# EAGLE design rpm-meter (EAGLE 6.5.0)
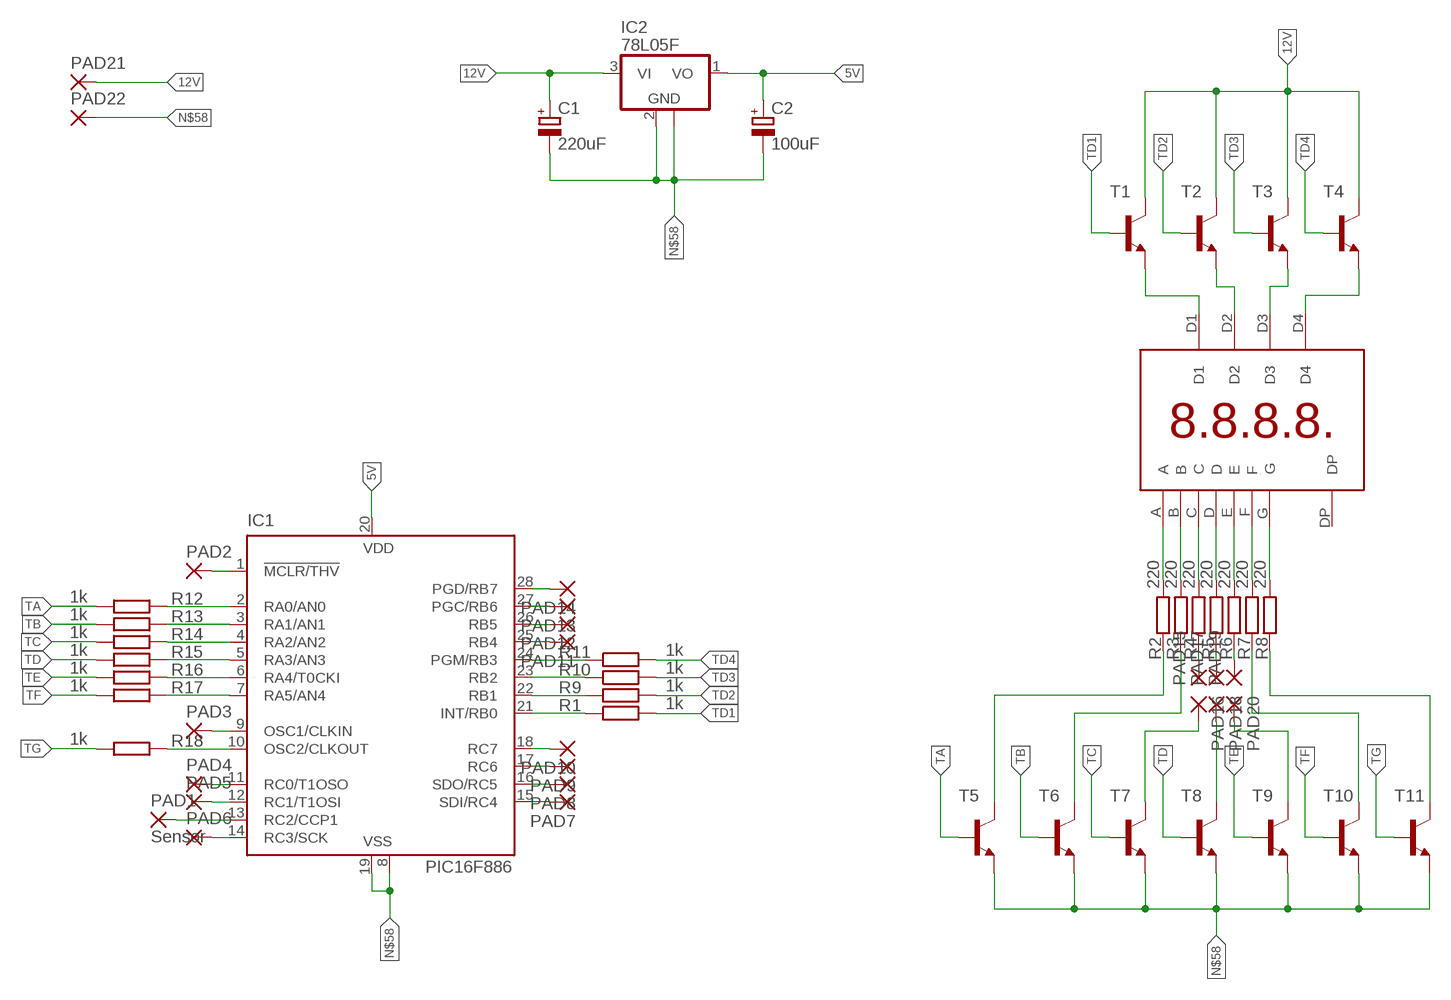
[diagram p0: schematic, sheet 1]

## Parts
C1  220uF  CPOL-EUE5-6  [E5-6]
C2  100uF  CPOL-EUE5-5  [E5-5]
IC1  PIC16F886  PIC16873P  [DIL28-3]
IC2  78L05F  [SOT89]
PAD1  Sensor  SMD5  [SMD2,54-5,08]
PAD2  SMD2  [SMD1,27-2,54]
PAD3  SMD2  [SMD1,27-2,54]
PAD4  SMD2  [SMD1,27-2,54]
PAD5  SMD2  [SMD1,27-2,54]
PAD6  SMD2  [SMD1,27-2,54]
PAD7  SMD2  [SMD1,27-2,54]
PAD8  SMD2  [SMD1,27-2,54]
PAD9  SMD2  [SMD1,27-2,54]
PAD10  SMD2  [SMD1,27-2,54]
PAD11  SMD2  [SMD1,27-2,54]
PAD12  SMD2  [SMD1,27-2,54]
PAD13  SMD2  [SMD1,27-2,54]
PAD14  SMD2  [SMD1,27-2,54]
PAD15  2,54/0,8  [2,54/0,8]
PAD16  2,54/0,8  [2,54/0,8]
PAD17  2,54/0,8  [2,54/0,8]
PAD18  2,54/0,8  [2,54/0,8]
PAD19  2,54/0,8  [2,54/0,8]
PAD20  2,54/0,8  [2,54/0,8]
PAD21  SMD5  [SMD2,54-5,08]
PAD22  SMD5  [SMD2,54-5,08]
R1  1k  R-EU_M0805  [M0805]
R2  220  R-EU_M0805  [M0805]
R3  220  R-EU_M0805  [M0805]
R4  220  R-EU_M0805  [M0805]
R5  220  R-EU_M0805  [M0805]
R6  220  R-EU_M0805  [M0805]
R7  220  R-EU_M0805  [M0805]
R8  220  R-EU_M0805  [M0805]
R9  1k  R-EU_M0805  [M0805]
R10  1k  R-EU_M0805  [M0805]
R11  1k  R-EU_M0805  [M0805]
R12  1k  R-EU_M0805  [M0805]
R13  1k  R-EU_M0805  [M0805]
R14  1k  R-EU_M0805  [M0805]
R15  1k  R-EU_M0805  [M0805]
R16  1k  R-EU_M0805  [M0805]
R17  1k  R-EU_M0805  [M0805]
R18  1k  R-EU_M0805  [M0805]
T1  -NPN-SOT23-EBC  [SOT23-EBC]
T2  -NPN-SOT23-EBC  [SOT23-EBC]
T3  -NPN-SOT23-EBC  [SOT23-EBC]
T4  -NPN-SOT23-EBC  [SOT23-EBC]
T5  -NPN-SOT23-EBC  [SOT23-EBC]
T6  -NPN-SOT23-EBC  [SOT23-EBC]
T7  -NPN-SOT23-EBC  [SOT23-EBC]
T8  -NPN-SOT23-EBC  [SOT23-EBC]
T9  -NPN-SOT23-EBC  [SOT23-EBC]
T10  -NPN-SOT23-EBC  [SOT23-EBC]
T11  -NPN-SOT23-EBC  [SOT23-EBC]
U$1  4X7SEG-CA  [4X7SEG-CA]

## Nets
5V: C2.+ IC1.20(VDD) IC2.1(VO)
12V: C1.+ IC2.3(VI) PAD21.1(P) T1.C T2.C T3.C T4.C
N$2: R2.2 U$1.A
N$3: R3.2 U$1.B
N$4: R4.2 U$1.C
N$5: R5.2 U$1.D
N$6: R6.2 U$1.E
N$7: R7.2 U$1.F
N$8: R8.2 U$1.G
N$9: T2.E U$1.D2
N$10: T3.E U$1.D3
N$11: T1.E U$1.D1
N$12: T4.E U$1.D4
N$13: PAD17.1(P) R5.1
N$14: PAD20.1(P) T9.C
N$15: R7.1 T10.C
N$16: R8.1 T11.C
N$17: PAD16.1(P) T7.C
N$18: R3.1 T6.C
N$19: R2.1 T5.C
N$20: IC1.21(INT/RB0) R1.1
N$21: IC1.22(RB1) R9.1
N$22: IC1.23(RB2) R10.1
N$23: IC1.24(PGM/RB3) R11.1
N$24: IC1.2(RA0/AN0) R12.1
N$25: IC1.3(RA1/AN1) R13.1
N$26: IC1.4(RA2/AN2) R14.1
N$27: IC1.5(RA3/AN3) R15.1
N$28: IC1.6(RA4/T0CKI) R16.1
N$29: IC1.7(RA5/AN4) R17.1
N$30: IC1.10(OSC2/CLKOUT) R18.1
N$31: IC1.13(RC2/CCP1) PAD1.1(P)
N$32: IC1.1(!MCLR/THV) PAD2.1(P)
N$33: IC1.9(OSC1/CLKIN) PAD3.1(P)
N$34: IC1.11(RC0/T1OSO) PAD4.1(P)
N$35: IC1.12(RC1/T1OSI) PAD5.1(P)
N$36: IC1.14(RC3/SCK) PAD6.1(P)
N$37: IC1.15(SDI/RC4) PAD7.1(P)
N$38: IC1.16(SDO/RC5) PAD8.1(P)
N$39: IC1.17(RC6) PAD9.1(P)
N$40: IC1.18(RC7) PAD10.1(P)
N$41: IC1.25(RB4) PAD11.1(P)
N$42: IC1.26(RB5) PAD12.1(P)
N$43: IC1.27(PGC/RB6) PAD13.1(P)
N$44: IC1.28(PGD/RB7) PAD14.1(P)
N$45: PAD15.1(P) R4.1
N$46: PAD19.1(P) R6.1
N$47: PAD18.1(P) T8.C
N$58: C1.- C2.- IC1.8(VSS) IC1.19(VSS) IC2.2(GND) IC2.2@1(GND) PAD22.1(P) T5.E T6.E T7.E T8.E T9.E T10.E T11.E
TA: R12.2 T5.B
TB: R13.2 T6.B
TC: R14.2 T7.B
TD: R15.2 T8.B
TD1: R1.2 T1.B
TD2: R9.2 T2.B
TD3: R10.2 T3.B
TD4: R11.2 T4.B
TE: R16.2 T9.B
TF: R17.2 T10.B
TG: R18.2 T11.B
Unconnected: U$1.DP

## Library data of the parts
C1 C2 = resistor:CPOL-EU: POLARIZED CAPACITOR, European symbol
IC1 = microchip:PIC16*873: MICROCONTROLLER flash type; OC_FARNELL: unknown; OC_NEWARK: unknown
IC2 = linear:78L*: POSITOIV-VOLTAGE REGULATORS Output up to 100 mA Source: http://focus.ti.com/lit/ds/symlink/ua78l05.pdf
PAD1 PAD21 PAD22 = wirepad:SMD5: SMD PAD
PAD2-PAD14 = wirepad:SMD2: SMD PAD
PAD15-PAD20 = wirepad:2,54/0,8: THROUGH-HOLE PAD
R1-R18 = rcl:R-EU_: RESISTOR, European symbol
T1-T11 = transistor:*-NPN-: NPN Transistror BF959 corrected 2008.03.06
U$1 = alijabobija:4X7SEG-CA

## Board
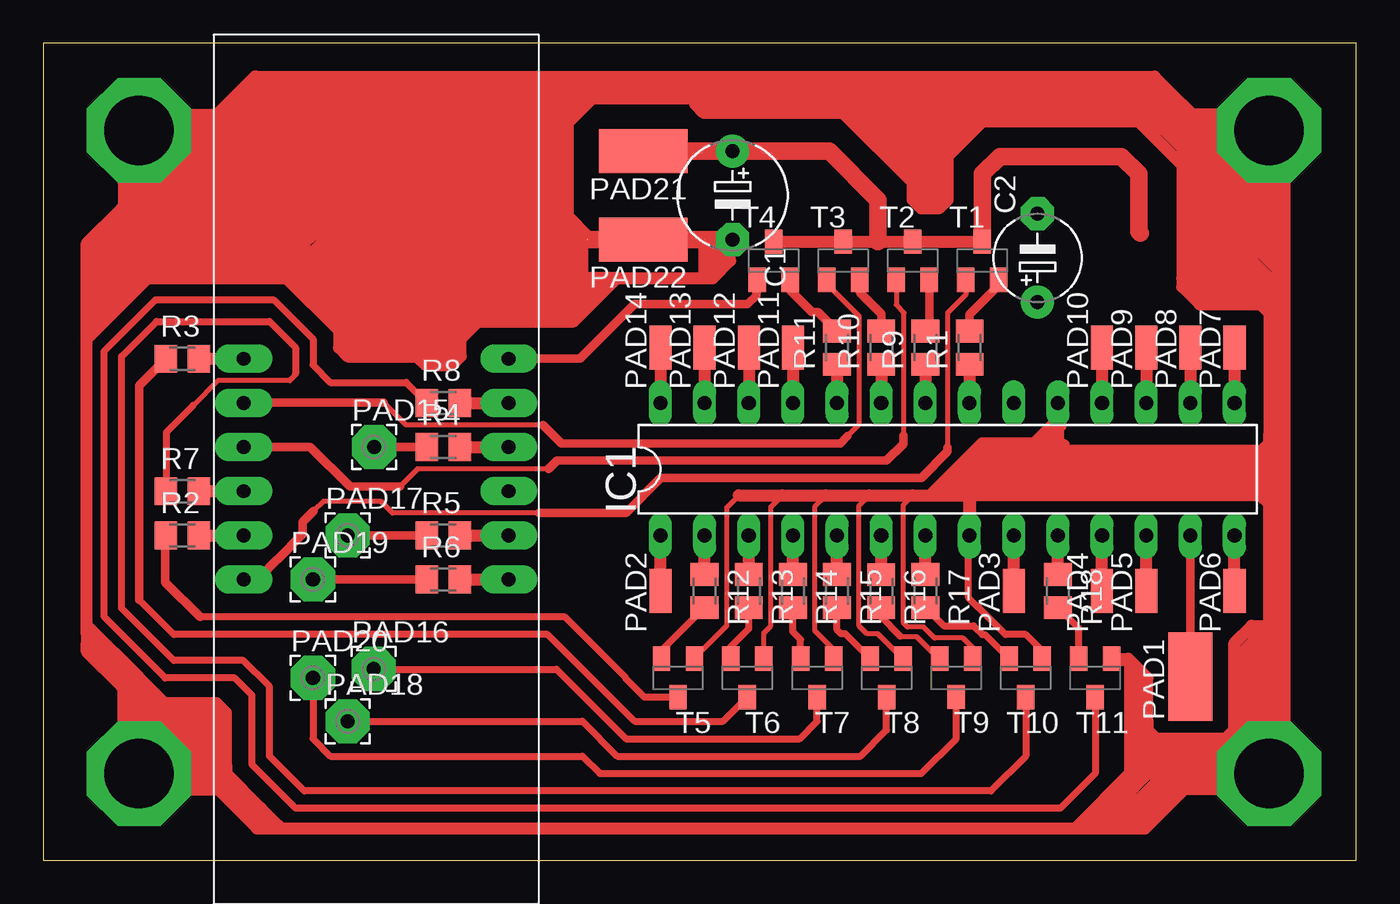
[diagram p1: board, top side]
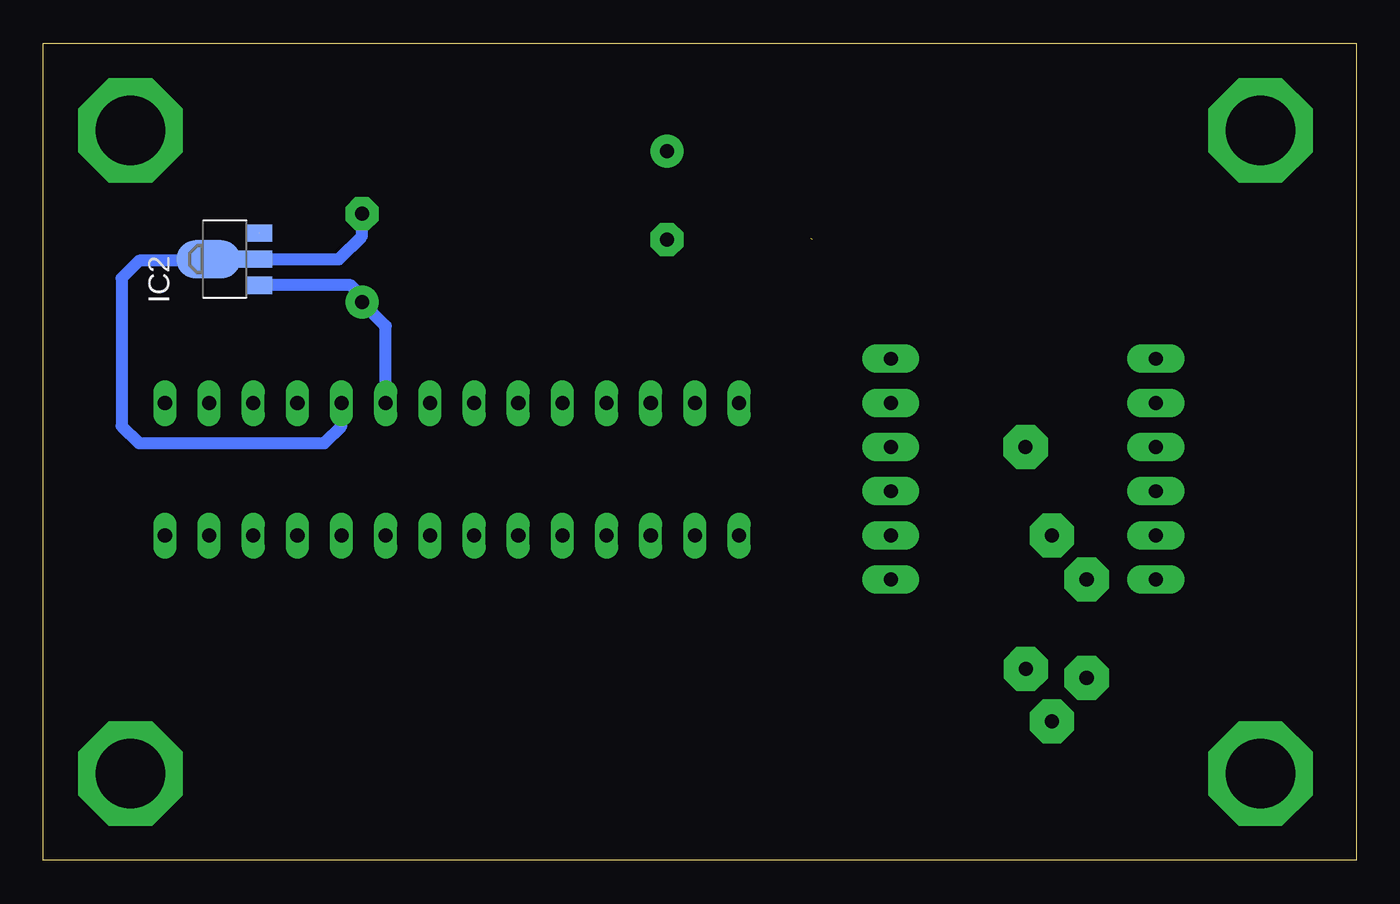
[diagram p2: board, bottom side, seen from below]

Size 75.5 x 47 mm. Coordinates in mm from the lower left corner, seen from the top.
Outline: 0,0 75.5,0 75.5,47 0,47 0,0
Copper layers (1*16): Top 0.035mm / dielectric 1.5mm / Bottom 0.035mm
Design rules "default": minimum track width 10mil, minimum drill 24mil, track to track 8mil, track to pad 8mil, pad to pad 8mil, via to via 8mil, smd to smd 8mil, copper to edge 40mil, drill to drill 8mil, minimum pad ring 10mil, minimum via ring 8mil, stop-mask expansion 4mil, vias tented up to drill 0mil, thermal gap 10mil

### Footprints (pad centres in the part's own frame; a part is rotated, then mirrored left to right if it is on the bottom)
E5-6 = drill 0.813 pad 1.905: + -2.54,0 | drill 0.813 pad 1.905 octagon: - 2.54,0
E5-5 = drill 0.813 pad 1.905: + -2.54,0 | drill 0.813 pad 1.905 octagon: - 2.54,0
DIL28-3 = drill 0.813 long: 1 -16.51,-3.81; 2 -13.97,-3.81; 3 -11.43,-3.81; 4 -8.89,-3.81; 5 -6.35,-3.81; 6 -3.81,-3.81; 7 -1.27,-3.81; 8 1.27,-3.81; 9 3.81,-3.81; 10 6.35,-3.81; 11 8.89,-3.81; 12 11.43,-3.81; 13 13.97,-3.81; 14 16.51,-3.81; 15 16.51,3.81; 16 13.97,3.81; 17 11.43,3.81; 18 8.89,3.81; 19 6.35,3.81; 20 3.81,3.81; 21 1.27,3.81; 22 -1.27,3.81; 23 -3.81,3.81; 24 -6.35,3.81; 25 -8.89,3.81; 26 -11.43,3.81; 27 -13.97,3.81; 28 -16.51,3.81
SOT89 = smd 1 x 1.5: 1 -1.499,-1.981; 3 1.499,-1.981 | smd 1 x 2: 2 0,-1.727 | smd 2.2 x 3.7: 2@1 0,0.94
SMD2,54-5,08 = smd 2.54 x 5.08: 1 0,0
SMD1,27-2,54 = smd 1.27 x 2.54: 1 0,0
2,54/0,8 = drill 0.813 pad 2.54 octagon: 1 0,0
M0805 = smd 1.3 x 1.6: 1 -0.95,0; 2 0.95,0
SOT23-EBC = smd 1 x 1.4: B 0.95,-1.1; C 0,1.1; E -0.95,-1.1
4X7SEG-CA = drill 0.8 pad 1.65 long: A -3.8,7.48; B 6.36,7.48; C 1.28,-7.76; D -3.8,-7.76; D1 -6.34,7.48; D2 1.28,7.48; D3 3.82,7.48; D4 6.36,-7.76; DP -1.26,-7.76; E -6.34,-7.76; F -1.26,7.48; G 3.82,-7.76

### Placement (x,y rotation side)
C1  39.64,38.26 270 top
C2  57.18,34.66 90 top
IC1  52,22.5 0 top
IC2  65.08,34.59 90 bottom
PAD1  65.97,10.58 0 top
PAD2  35.49,15.5 0 top
PAD3  55.81,15.5 0 top
PAD4  60.89,15.5 0 top
PAD5  63.43,15.5 0 top
PAD6  68.51,15.5 0 top
PAD7  68.51,29.5 0 top
PAD8  65.97,29.5 0 top
PAD9  63.43,29.5 0 top
PAD10  60.89,29.5 0 top
PAD11  43.11,29.5 0 top
PAD12  40.57,29.5 0 top
PAD13  38.03,29.5 0 top
PAD14  35.49,29.5 0 top
PAD15  19.01,23.78 0 top
PAD16  19,11.01 0 top
PAD17  17.5,18.7 0 top
PAD18  17.5,8 0 top
PAD19  15.5,16.16 0 top
PAD20  15.5,10.5 0 top
PAD21  34.5,40.8 90 top
PAD22  34.5,35.72 90 top
R1  53.27,29.5 90 top
R2  8,18.7 0 top
R3  8,28.86 0 top
R4  23,23.78 0 top
R5  23,18.7 0 top
R6  23,16.16 0 top
R7  8,21.24 0 top
R8  23,26.32 0 top
R9  50.73,29.5 90 top
R10  48.19,29.5 90 top
R11  45.65,29.5 90 top
R12  38.03,15.5 270 top
R13  40.57,15.5 270 top
R14  43.11,15.5 270 top
R15  45.65,15.5 270 top
R16  48.19,15.49 270 top
R17  50.73,15.5 270 top
R18  58.35,15.5 270 top
T1  54,34.5 0 top
T2  50,34.5 0 top
T3  46,34.5 0 top
T4  42,34.5 0 top
T5  36.5,10.5 180 top
T6  40.49,10.5 180 top
T7  44.5,10.5 180 top
T8  48.5,10.5 180 top
T9  52.5,10.51 180 top
T10  56.5,10.5 180 top
T11  60.5,10.5 180 top
U$1  19,22.5 90 top

### Tracks (layer width: path | path; a pad name or v marks a point on that pad's centre or on a via)
5V
  Bottom 0.7: IC1.20 55.81,30.75 C2.+ 57.18,32.44 57.83,33.09 IC2.1
12V  (1 unrouted)
  Top 0.7: T4.C T3.C 48,35.6 T2.C T1.C
  Top 1: PAD21.1 C1.+ 45.2,40.8 48,38 48,35.6 | T1.C 54,39.5 55,40.5 62,40.5 63,39.5 63,36.19 IC2.3
N$1
  Top 0.7: 11.04,42.27 8.27,42.27 8.09,42.09 8.09,42.44 8.54,42.89 10.52,42.89 10.66,42.75
N$2
  Top 0.7: R2.2 U$1.A
N$3
  Top 0.7: R3.2 U$1.B
N$4
  Top 0.7: R4.2 U$1.C
N$5
  Top 0.7: R5.2 U$1.D
N$6
  Top 0.7: R6.2 U$1.E
N$7
  Top 0.7: R7.2 U$1.F
N$8
  Top 0.7: R8.2 U$1.G
N$9
  Top 0.3: T2.E 49.05,31.95 49.5,31.5 49.47,31.5 49.46,31.51 49.46,24.44 | 29.03,22.49 29.03,22.5 29.05,22.52 21.52,22.52 20.5,21.5
  Top 0.5: 11.55,23.81 U$1.D2 15.35,23.79 17.64,21.5 20.5,21.5 | 49.46,24.44 49.46,23.96 48.5,23 29.53,23 29.05,22.52
N$10
  Top 0.3: T3.E 45.05,33.18 46.91,31.32 46.91,31.31 46.92,31.3 46.92,25.08 46.25,24.41 | 28.72,25.06 28.73,25.05 20.85,25.05 19.57,26.33
  Top 0.5: 11.55,26.29 U$1.D3 19.57,26.33 | 46.25,24.41 45.83,23.99 29.79,23.99 28.73,25.05
N$11
  Top 0.3: T1.E 53.05,32.55 52,31.5 52.02,31.5 52.01,31.49 52.01,23.75 | 28.5,19.98 20.07,19.98 19.41,20.66 16.11,20.66 15.54,20.09
  Top 0.5: 15.54,20.09 14.92,19.47 14.92,18.77 13.46,17.31 13.45,17.31 12.45,16.31 11.67,16.31 U$1.D1 | 52.01,23.75 52.01,23.51 50.5,22 35.5,22 33.5,20 28.52,20 28.5,19.98
N$12
  Top 0.5: U$1.D4 30.86,28.86 34,32 40.5,32 41,32.5 41,33.35 T4.E
N$13
  Top 0.5: R5.1 PAD17.1
N$14
  Top 0.4: PAD20.1 15.5,7 16.5,6 31,6 32,5 50.5,5 52.5,7 T9.C
N$15
  Top 0.3: 14.5,28 14.5,27.94 14.22,27.66 14.22,27.65 14.2,27.63 14.2,27.62 14.18,27.6 10.03,27.6 8.61,26.18
  Top 0.4: 14.5,28 14.5,29.5 13,31 6.5,31 4.5,29 4.5,14.5 7.5,11.5 11.5,11.5 13,10 13,6 15,4 54.5,4 56.5,6 T10.C | 8.61,26.18 8.61,26.17 7.06,24.62 R7.1
N$16
  Top 0.4: R8.1 20.87,27.5 16.5,27.5 15.5,28.5 15.5,30 13.24,32.26 6.45,32.26 3.5,29.31 3.5,14 7,10.5 11,10.5 12,9.5 12,5.5 14.5,3 58.5,3 60.5,5 T11.C
N$17
  Top 0.4: PAD16.1 29.5,11 33.5,7 43.5,7 44.5,8 T7.C
N$18
  Top 0.4: 5.5,15 7.5,13 29,13 34,8 39.09,8 T6.C
  Top 0.5: T6.C 40.49,8.99 | 5.5,15 5.5,27.31 R3.1
N$19
  Top 0.4: T5.C 34.55,9.4 33.5,10.45 33.5,10.5 30,14 9,14
  Top 0.5: R2.1 7,18.65 7,16 9,14 | 36.47,9.37 T5.C
N$20
  Top 0.7: R1.1 IC1.21
N$21
  Top 0.7: R9.1 IC1.22
N$22
  Top 0.7: R10.1 IC1.23
N$23
  Top 0.7: R11.1 IC1.24
N$24
  Top 0.7: R12.1 IC1.2
N$25
  Top 0.7: R13.1 IC1.3
N$26
  Top 0.7: R14.1 IC1.4
N$27
  Top 0.7: R15.1 IC1.5
N$28
  Top 0.7: R16.1 IC1.6
N$29
  Top 0.7: R17.1 IC1.7
N$30
  Top 0.7: R18.1 IC1.10
N$31
  Top 0.5: PAD1.1 IC1.13
N$32
  Top 0.7: PAD2.1 IC1.1
N$33
  Top 0.7: PAD3.1 IC1.9
N$34
  Top 0.7: PAD4.1 IC1.11
N$35
  Top 0.7: PAD5.1 IC1.12
N$36
  Top 0.7: PAD6.1 IC1.14
N$37
  Top 0.7: PAD7.1 IC1.15
N$38
  Top 0.7: PAD8.1 IC1.16
N$39
  Top 0.7: PAD9.1 IC1.17
N$40
  Top 0.7: PAD10.1 IC1.18
N$41
  Top 0.7: PAD11.1 IC1.25
N$42
  Top 0.7: PAD12.1 IC1.26
N$43
  Top 0.7: PAD13.1 IC1.27
N$44
  Top 0.7: PAD14.1 IC1.28
N$45
  Top 0.5: R4.1 PAD15.1
N$46
  Top 0.5: R6.1 PAD19.1
N$47
  Top 0.4: PAD18.1 31,8 33,6 47,6 48.5,7.5 T8.C
N$48
  Top 0.406: 59.5,23 58.85,23 58.85,23.66 58.54,23.66 58.54,23.45
N$51
  Top 0.406: 57.3,23.04 69.95,22.92 | 69.95,22.92 69.95,23.67 | 69.95,23.67 69.95,23.69 58.26,23.74 58.69,24.07 58.81,23.98 57.85,23.33 69.71,23.24 69.73,23.45 59.12,23.55 | 69.58,23.72 69.95,23.67 | 69.95,22.92 69.95,22.47
N$53
  Top 0.7: 70.53,41.99 68.38,41.99 67.48,42.89 65.89,42.89 65.86,42.92
N$54
  Top 0.7: 70.55,4.23 67.64,4.23 67.5,4.09 65.57,4.09 65.44,3.96
N$55
  Top 0.7: 70.98,4.72 66.52,4.72 66.39,4.59
N$56
  Top 0.7: 5.89,5.44 9.46,5.44 9.64,5.62
N$57
  Top 0.7: 63.34,2.48 65.75,4.89
N$58  (via drill 4 pad 6)  (1 unrouted)
  Top 0.3: 37.45,11.55 T5.E 37.45,11.65 39.31,13.51 39.31,20.31 40,21 | T6.E 41.44,13.1 41.84,13.5 41.84,20.34 42.5,21 | T7.E 45.45,12.13 44.38,13.2 44.38,20.38 45,21 | T8.E 49.43,11.6 47.99,13.04 47.38,13.04 46.92,13.5 46.92,20.42 47.5,21 | T9.E 53.45,12.23 52.88,12.8 51.25,12.8 50.62,13.43 49.7,13.43 49.5,13.63 49.49,13.63 49.47,13.65 49.47,20.47 50,21
  Top 0.4: T10.E 57.45,12.05 56.5,13 55.34,13 53.81,14.53 53.79,14.53 53.21,15.11 53.21,18.63 IC1.8
  Top 0.5: 63,43 64,42
  Top 0.7: 30,35.5 30,31.5 24.5,31.5 23.5,30.5 23.5,30 | 23.5,29.5 23.5,29 22,29 21.5,29.5 | 21.5,29.5 23.5,29.5 | 23.5,29.5 23.5,30 | 23.5,30 23,30.5 23.5,31 23.5,31.5 | 23.5,31.5 24,32 29.5,32 29.5,35.5 26,35.5 20,29.5 | 20,29.5 20.5,29.5 22.5,31.5 | 22.5,31.5 24,33 | 24,33 26,35 29,35 29,32.5 24,32.5 21,29.5 21.5,29.5 | 21.5,29.5 22.5,30.5 23,30 22.5,30 22.5,31 24.5,33 | 24.5,33 26,34.5 28.5,34.5 28.5,33 25,33 | 24.5,33 25,33 | 25,33 26,34 28,34 28,33.5 26,33.5 | 23.5,30 24.5,31 24,31.5 23.5,31.5 | 23.5,31.5 23,31 | 24,33 24,34.5 23.5,35 23.5,35.5 24.5,34.5 25.5,35.5 24,35.5 24.5,35 | 22.5,31.5 19,31.5 17,33.5 17,35 18.5,36.5 18,36.5 | 20,29.5 17.5,29.5 17.5,30.5 | 17.5,30.5 14.5,33.5 | 14.5,33.5 14,34 | 71,22 71,24 | 71,24.5 71,24 | 71,24 70.5,23.5 | 70.5,23.5 70.5,24 | 70.5,24 70,23.5 70,23 70.5,22.5 70.5,23 | 70.35,5.78 69.22,5.78 68,7 64,7 | IC1.19 58.35,24.35 56.5,22.5 54.19,22.5 53.28,21.59 IC1.8 53.27,21 | 53.27,21 53.27,21.62 54.16,22.51 69.99,22.51 71,21.5 71,10 | 40,21 42.5,21 45,21 47.5,21 50,21 51,21 | 51,21 53.27,21 | 62.5,11.5 61.55,11.5 T11.E 62.4,11.6 62.5,11.5 | 64.5,43.5 65.5,42.5 70.5,42.5 | 65.75,42.25 66,42 | 10.98,36.52 7.5,40 | 7.5,40 7,40.5 | 7,40.5 v5.5,42 | v5.5,5 5.5,6.5 | 5.5,10.5 2.5,13.5 | 2.5,13.5 2.5,30 | 2.5,30 5.5,33 | 5.5,33 5.5,37 | 5.5,37 5.5,38 | 5.5,38.5 5.5,39.5 | 5.5,39.5 v5.5,42 | 26.14,42.5 30,42.5 | 63,11 63,8 | 63,8 63,7.5 | 63,7.5 65,5.5 70,5.5 70.1,5.4 | 70.5,6 v70.5,5 70.2,5.3 70,5.3 | 70.5,7.11 70.5,7.5 | v5.5,5 10.5,5.5 | 10.5,5.5 10.5,8.5 10,9 | 10,9 7,9 5.5,10.5 | 5.5,10.5 5.5,10 | 5.5,6.5 6,6 7,6 | 7,6 10,6 10,8.5 7,8.5 6,9.5 6,7.5 | 6,7.5 6,6.5 9.5,6.5 9.5,8 7,8 6.5,8.5 6.5,7.5 | 6.5,7.5 6.5,7 9,7 9,7.5 6.5,7.5
  Top 0.7: 6.5,7.5 5.5,6.5 | 5.5,6.5 5.5,9 | 5.5,9.5 5.5,10 | 5.5,10 2.5,13 | 2.5,13 2.5,13.5 | 2.5,13 2.5,12.5 | 2.5,12.5 4.5,10.5 | 4.61,10.39 5.5,9.5 | 5.5,9.5 5.5,9 | 5.5,9 5,9.5 | 4.5,10 2.5,12 2.5,12.5 | 2.5,30 2.5,35.5 4.5,37.5 | 5,38 5.5,38.5 | 5.5,38 4.61,37.11 | 4.5,37 3,35.5 3,31.5 | 3,31.5 3,31 5,33 5,33.5 | 5,33.5 5,37 3.5,35.5 3.5,32.5 | 3.5,32 3.5,32.5 | 3.5,32.5 4.5,33.5 4.5,36 | 4.5,36 4,35.5 4,33.5 | 9.07,42 9.14,42 | 9.14,42 12.23,45.09 63.91,45.09 67,42 | 66.5,42 64,44.5 47,44.5 | 47,44.5 27.5,44.5 | 27.5,44.5 12.5,44.5 8,40 8,40.5 | 8,40.5 9,41.5 8,41.5 8,40.5 | 8,40.5 7.5,40.5 6.5,41.5 7.5,41.5 7.5,41 7,41 | 7,41 6.5,40.5 | 6.5,40.5 6,40 6,41 7,41 | 7,41 11,37 20,37 | 20,37 26,43 | 26,43 26.5,43 | 26.5,43 30,43 30.5,43.5 | 30.5,43.5 31,44 12.5,44 12.16,43.66 | 12,43.5 8.5,40 11,37.5 19.5,37.5 | 19.5,37.5 20,37.5 | 20,37.5 20.5,38 | 25,42.5 26,43.5 | 26,43.5 30.5,43.5 | 26,43.5 12.5,43.5 9,40 11,38 | v5.5,42 9.07,42 | 9.14,42 14.5,42 20,36.5 20,37 | 26,43 27.5,44.5 | v5.5,5 8.5,5.5 | v5.5,5 9.12,5 12.28,1.84 63.37,1.84 66.83,5.3 70,5.3 | 71,9.5 71,6.5 | 71,6.5 71,6.3 | 71,6.3 70.1,5.4 | 70.1,5.4 70,5.3 | 6.46,9.06 9.94,9.06 10,9 | 10.5,5.5 10.5,5 12.5,3 | 12.5,3 13.5,2 13,2 12.5,2.5 | 12.5,2.5 12,2.5 9.5,5 10,5 10.5,4.5 10.5,4 12.5,2 | 12.5,2.5 12.5,3 | 63,11 62.5,11.5 | 62.5,11.5 62.5,5 59.5,2 60.5,2 60.5,2.5 63,5 63,7 | 63,7.5 63,7 | 63,7 65,5 65.5,5 | 66,5 65.5,5 | 65.5,5 63,2.5 61.5,2.5 61,2 63,2 63.5,2.5 62,2.5 61.5,3 63,3 64.5,4.5 64.5,5 63.5,6 63.5,5 62,3.5 63,3.5 64,4.5 64,5 63.52,5 60.83,2.31 | 63.5,7.5 63,8 | 63,8 63.5,8 | 63.5,8 63.5,10.5 63,11 | 63.5,8 63.5,7.5 | 63.5,7.5 64,7 | 64,7 65,6 68.5,6 68,6.5 67.5,6.5 | 65,6.5 67.5,6.5 | 67.5,6.5 71,10 | 71,10 71,9.5
  Top 0.7: 71,9.5 68.5,7 | 68.5,7 69.5,6 70,6 70,8 | 70,8 70.5,8.5 | 70,8 69.5,7.5 | 69.5,7.5 69,7 69.5,6.5 69.5,7.5 | 69.5,7.5 70,7.5 70.5,8 68.5,8 | 68.5,8 68.5,10 | 68.5,10 68.5,11 | 68.5,11 68.5,11.5 | 69.5,12.5 70.5,13.5 | 70.5,13.5 70.5,20.5 | 70.5,20.5 70.5,21.5 | 70.5,21.5 70,22 | 70.5,12.5 70.5,12 | 70.5,12 68.5,10 | 68.5,7 68.5,8 | 68.5,8 70.5,10 70.5,12 | 70.5,13 70.5,12.5 | 70.5,12.5 69,11 69,10 | 69,10 69,9 69.5,9.5 | 69.5,9.5 70,10 70,11 69,10 | 69,10 69.5,10 | 69.5,9.5 69.5,10 | 69.5,10 68.5,11 | 68.5,11 70,12.5 69.5,12.5 | 69.5,12.5 68.5,11.5 | 68.5,11.5 68.5,12.5 69.5,13.5 70.5,13.5 | 67,4.5 69,4.5 70.5,6 | 70.5,6 71,6.5 | 71,6.3 71,4 68.5,4 | 3,31.5 5,33.5 | 4.5,36 5.5,37 | 5.5,38 5.5,38.5 | 5.5,39.5 5.09,39.5 4.61,39.02 4.61,37.11 | 4.61,37.11 4.5,37 | 4.5,37 4.5,37.5 | 4.5,37.5 5,38 | 5,38 5,39 | 6,7.5 5.11,7.5 4.61,8 4.61,10.39 | 4.61,10.39 4.5,10.5 | 4.5,10.5 4.5,10 | 4.5,10 5,9.5 | 5,9.5 5,7.5 | 70.5,6 70.5,7.11 | 70.5,7.11 71.39,8 71.39,42.11 71,42.5 | 71,42.5 67,42.5 66.5,42 | 66.5,42 66.5,35.5 67.5,35.5 68,35 70,35 71,34 71,42 70.5,41.5 67.5,41.5 | 67.5,41.5 67,41.5 67,36 67.5,36 68,35.5 70,35.5 70.5,35 70.5,41 67.5,41 67.5,36.5 68,36 70,36 70,40.5 68,40.5 68,37 | 68,37 68,36.5 69.5,36.5 69.5,40 68.5,40 68.5,39.5 | 68.5,39.5 68.5,37.5 68,37 | 68,37 69,37 69,39.5 | 67.5,41.5 67.5,42.88 67.49,42.89 70.61,42.89 71,42.5 | 7,6 7,5.63 8.53,4.1 10.92,4.1 13.04,1.98 | 9.07,42 12.16,45.09 12.16,43.66 | 12.16,43.66 12,43.5 | 12,43.5 24.5,43.5 25,43 12.5,43 9.5,40 11.5,38 19,38 | 19,38 20.5,38 | 20.5,38 21,38.5 | 24.5,42 25,42.5 | 25,42.5 12.5,42.5 10,40 11.5,38.5 21,38.5 | 21,38.5 24.5,42 | 24.5,42 12.5,42 10.5,40 11.5,39 21,39 23.5,41.5 12.5,41.5 11,40 11.5,39.5 21,39.5 22.5,41 12.5,41 12,40.5
  Top 0.7: 12,40.5 11.5,40 21,40 21.5,40.5 12,40.5 | 70.5,23.5 70.5,21.5 | 70.5,20.5 70,21 55,21 | 55,21 53.5,21 | 53.5,21 54.5,22 69.5,22 70,21.5 55.5,21.5 | 54.5,21.5 55.5,21.5 | 55.5,21.5 55,21 | 53.5,21 53.27,21 | 51,21 54,24 57,24 58.5,25.5 58.5,25 56.5,23 54.5,23 53,21.5 52.5,21.5 | 54.5,23.5 56.5,23.5 | 52,21.5 52.5,21.5 | 52.5,21.5 54.5,23.5 | 54.5,23.5 54,23.5 52.5,22 | 66,36.5 66,33 | 66,33 67,32 | 67,32 70,32 70.5,31.5 | 71,31 70.5,31.5 | 70.5,31.5 70.5,24.5 | 70.5,24 70.5,24.5 | 70.5,24.5 71,25 71,33 | 71,33 70,34 67,34 66.5,33.5 66.5,33 67,32.5 70,32.5 70.5,32 70.5,33 70,33.5 67,33.5 67,33 70,33 | 71,33 71,33.5 70.5,33.5 69.5,34.5 67,34.5 66.5,34 66.5,35 67.5,35 | 68.5,39.5 66,39.5 65.5,40 | 65.5,40 63,42.5 | 61.5,44 62.5,43 | 63,42.5 54,42.5 52,40.5 52,38 51.5,37.5 50.5,37.5 50,38 50,39 46,43 38,43 37.5,43.5 46,43.5 | 46,43.5 46.5,43.5 50.5,39.5 50.5,39 | 50.5,39 50.5,38 51,38 | 51,38 51.5,38 51.5,40.5 54,43 63,43 63.5,43 65.5,41 | 65.5,41 65.5,40.5 | 65.5,41 65.5,42 65,42 63.5,43.5 47,43.5 51,39.5 | 51,39.5 51,38 | 51,39.5 51,40.5 | 53,42.5 53.5,43 | 53.5,43 53,43 | 53,43 48,43 50.5,40.5 51,40.5 | 51,40.5 53,42.5 | 53,42.5 49,42.5 49.5,42 | 49.5,42 50.5,41 51,41 | 51,41 52,42 50,42 | 49.5,42 50,42 | 50,42 51,41 | 51,41 51,41.5 51.5,41.5 53,43 | 53.5,43 62.5,43 | 62.5,43 63,42.5 | 65.5,40 65.5,33.5 | 65.5,33.5 66,33 | 65.5,33.5 65.5,33 66.5,32 67,32 | 19,38 19.5,37.5 | 20,37.5 22,37.5 23,36.5 23,36 29.5,36 30,36.5 29.5,36.5 29.5,42 26,42 22,38 23.5,36.5 29,36.5 29,41.5 26,41.5 22.5,38 23.5,37 28.5,37 28.5,41 26,41 23,38 23.5,37.5 28,37.5 28,40.5 26,40.5 23.5,38 27.5,38 27.5,40 26,40 24.5,38.5 27,38.5 27,39.5 26,39.5 25.5,39 26.5,39
  Top 0.7: 6,39.5 6,38.5 | 6,34 6,33.5 | 5.5,33 6,33.5 | 6,33.5 14,33.5 17,30.5 17,29.5 17.5,29 21.5,29 22,28.5 23.5,28.5 24,29 24,30 25,31 30.5,31 33,33.5 | 33,33.5 38,33.5 | 38,33.5 38.5,33.5 39.5,34.5 39.5,35.5 38,35.5 38,33.5 | 38,33.5 38.5,34 38.5,35 39,35 39,34.5 | 33,33.5 31,33.5 31,35.5 30.5,36 30.5,31.5 32,33 31,33 31,32.5 | 14,34 6,34 | 6,34 6,38.5 | 6,38.5 6.5,39 7,39 7.5,39.5 | 7.5,39.5 6.5,40.5 | 6.5,40.5 6.5,39.5 | 7.5,40 7,40 6.5,39.5 | 6.5,39.5 6.5,34.5 13.5,34.5 | 13.5,34.5 14,34 | 17.5,30.5 18,30 20,30 21,31 19,31 16.5,33.5 16.5,35 17.5,36 17,36 16,35 16,33.5 19,30.5 | 19,30.5 20,30.5 | 19,30.5 18.5,30.5 18,31 | 15.5,33.5 15.5,33 18,30.5 18,31 | 18,31 15.5,33.5 | 15.5,33.5 15.5,35 16.5,36 15.5,36 15,35.5 15,34 | 15,34 15,33.5 14.5,34 | 14.5,34 14.5,34.5 | 14.5,34.5 14.5,35.5 | 14.5,35.5 15,36 14.5,36 14.5,35.5 | 14.5,34.5 14,35 14,36 13,36 | 13,36 11,36 8,39 | 8,39 7.5,39.5 | 7.5,39.5 7.5,39 7,38.5 | 7,38.5 7,35 13.5,35 | 13.5,35 13.5,35.5 7.5,35.5 7.5,38.5 8,39 | 8,39 8,38.5 10.5,36 8,36 8,38 9.5,36.5 9,36.5 8.5,37 8.5,36.5 | 13,36 13,35 13.5,34.5 | 14.5,33.5 15,34 | 15,34 14.5,34 | 14.5,34 13.5,35 | 47,44.5 46,43.5 | 46,43.5 50.5,39 | 7,38.5 7,40.5 | 29.72,35.72 30.5,36.5 31,36 31.13,36 31.36,35.77 34.45,35.77 PAD22.1 | 26.5,43 26.5,42.92 21.21,37.63 18.65,37.63 17.33,36.31 11.43,36.31 11.22,36.52 20.99,36.52 21.47,37 21.95,37 21.98,36.97 21.98,32.09 21.78,31.89 21.78,31.92 22.33,32.47 22.33,36.49 22.41,36.57 22.41,36 22.67,35.74 22.67,32.73 22.64,32.7 22.64,32.9 22.93,33.19 22.93,35.48 22.96,35.51 23.07,35.51 23.3,35.28 23.3,33.39 23.48,33.21 23.48,34 23.56,34.08 23.56,34.74 23.45,34.85 23.45,34.88 21.15,37.18 20.73,37.18 20.55,37 21.12,37 21.58,36.54 21.58,32 21.47,31.89 21.47,36.14 21.32,36.29 21.32,32.04 21.29,32.01 21.27,32.01 20.98,31.72 20.98,36.46 20.95,36.49 20.9,36.49 20.61,36.2 20.61,31.81 20.52,31.72 20.26,31.72 20.23,31.75 20.23,36.46 20.03,36.46 19.83,36.26 19.83,31.87 19.77,31.81 19.54,31.81 19.46,31.89 19.46,36.11 18.6,36.11 17.31,34.82 17.31,33.55 18.88,31.98 18.88,35.74
  Top 0.7: 18.88,35.86 18.88,35.74 | 18.88,35.74 17.76,34.62 17.76,33.57 18.4,32.93 18.4,35.14
  Top 1: C1.- 31.28,35.72 30,37 30,42.5 31.5,44 61.5,44 64,44 65.5,42.5 65.75,42.25 | IC2.2@1 66,34.61 66,36.5 66,42 66.5,42 67,42 v70.5,42
  Bottom 0.7: IC2.2 IC2.2@1 | IC2.2 65.91,34.59 66,34.5 70,34.5 71,33.5 71,25 70,24 59.35,24 58.35,25 IC1.19 | IC2.2 58.51,34.59 57.18,35.92 C2.-
N$59
  Top 0.7: 8.02,5.65 8.02,5.41 8.91,4.52
TA
  Top 0.4: T5.B 35.55,12.07 R12.2
TB
  Top 0.4: T6.B 39.54,12.31 40.57,13.34 R13.2
TC
  Top 0.4: T7.B 43.55,12.71 43.11,13.15 R14.2
TD
  Top 0.4: T8.B 47.55,11.62 46.13,13.04 45.87,13.04 45.65,13.26 R15.2
TD1
  Top 0.5: T1.B 54.95,33.09 53.27,31.41 R1.2
TD2
  Top 0.5: T2.B 50.95,30.67 R9.2
TD3
  Top 0.5: T3.B 46.95,32.68 48.21,31.42 48.21,30.47 R10.2
TD4
  Top 0.5: T4.B 42.95,32.81 44.2,31.56 44.54,31.56 R11.2
TE
  Top 0.3: 51.55,11.72 51.38,11.72 50.24,12.86 49.33,12.86 49.29,12.9
  Top 0.4: T9.B 51.55,11.72 | 49.29,12.9 48.19,14 R16.2
TF
  Top 0.4: R17.2 51.78,13.5 53.5,13.5 54,13 54.15,13 T10.B
TG
  Top 0.4: T11.B 59.55,13.35 R18.2